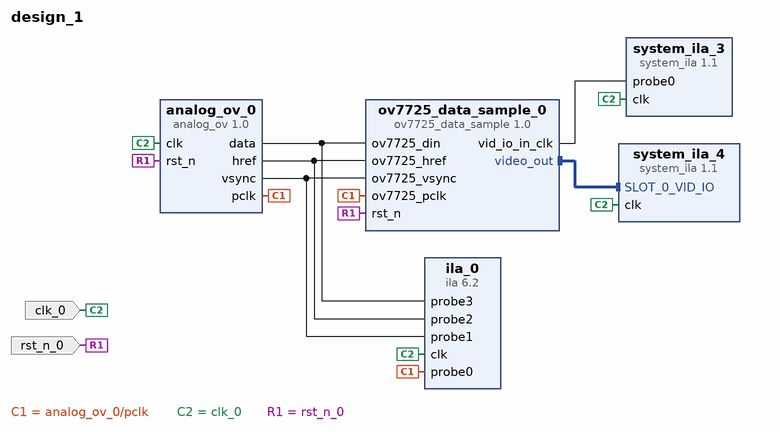
[diagram p0: block diagram of the top level]
# Vivado block design design_1, xc7z010clg400-1, Vivado 2021.1
create_bd_design design_1

create_bd_port -dir I -type clk clk_0
create_bd_port -dir I -type rst rst_n_0

create_bd_cell -type ip -vlnv xilinx.com:user:analog_ov:1.0 analog_ov_0
create_bd_cell -type ip -vlnv xilinx.com:user:ov7725_data_sample:1.0 ov7725_data_sample_0
create_bd_cell -type ip -vlnv xilinx.com:ip:system_ila:1.1 system_ila_3
set_property -dict {CONFIG.C_MON_TYPE NATIVE CONFIG.C_NUM_OF_PROBES 1 CONFIG.C_PROBE0_TYPE 0} [get_bd_cells system_ila_3]
create_bd_cell -type ip -vlnv xilinx.com:ip:system_ila:1.1 system_ila_4
set_property -dict [list \
  CONFIG.C_MON_TYPE INTERFACE \
  CONFIG.C_NUM_MONITOR_SLOTS 1 \
  CONFIG.C_SLOT_0_INTF_TYPE xilinx.com:interface:vid_io_rtl:1.0 \
  CONFIG.C_SLOT_0_TYPE 0 \
] [get_bd_cells system_ila_4]
create_bd_cell -type ip -vlnv xilinx.com:ip:ila:6.2 ila_0
set_property -dict [list \
  CONFIG.C_DATA_DEPTH 4096 \
  CONFIG.C_ENABLE_ILA_AXI_MON false \
  CONFIG.C_MONITOR_TYPE Native \
  CONFIG.C_NUM_OF_PROBES 4 \
  CONFIG.C_PROBE3_WIDTH 8 \
] [get_bd_cells ila_0]

# ---- connections ----

connect_bd_intf_net -intf_net ov7725_data_sample_0_video_out [get_bd_intf_pins ov7725_data_sample_0/video_out] [get_bd_intf_pins system_ila_4/SLOT_0_VID_IO]
connect_bd_net [get_bd_pins analog_ov_0/data] [get_bd_pins ov7725_data_sample_0/ov7725_din] [get_bd_pins ila_0/probe3]
connect_bd_net [get_bd_pins analog_ov_0/href] [get_bd_pins ov7725_data_sample_0/ov7725_href] [get_bd_pins ila_0/probe2]
connect_bd_net [get_bd_pins analog_ov_0/pclk] [get_bd_pins ov7725_data_sample_0/ov7725_pclk] [get_bd_pins ila_0/probe0]
connect_bd_net [get_bd_pins analog_ov_0/vsync] [get_bd_pins ov7725_data_sample_0/ov7725_vsync] [get_bd_pins ila_0/probe1]
connect_bd_net -net clk_0_1 [get_bd_ports clk_0] \
  [get_bd_pins analog_ov_0/clk] [get_bd_pins system_ila_3/clk] [get_bd_pins system_ila_4/clk] [get_bd_pins ila_0/clk]
connect_bd_net -net ov7725_data_sample_0_vid_io_in_clk [get_bd_pins ov7725_data_sample_0/vid_io_in_clk] [get_bd_pins system_ila_3/probe0]
connect_bd_net -net rst_n_0_1 [get_bd_ports rst_n_0] [get_bd_pins analog_ov_0/rst_n] [get_bd_pins ov7725_data_sample_0/rst_n]
set_property HDL_ATTRIBUTE.DEBUG true [get_bd_intf_nets ov7725_data_sample_0_video_out]
set_property HDL_ATTRIBUTE.MARK_DEBUG true [get_bd_intf_nets ov7725_data_sample_0_video_out]
set_property HDL_ATTRIBUTE.DEBUG true [get_bd_nets ov7725_data_sample_0_vid_io_in_clk]
set_property HDL_ATTRIBUTE.MARK_DEBUG true [get_bd_nets ov7725_data_sample_0_vid_io_in_clk]

validate_bd_design
save_bd_design
